# Altium schematic sheet EPS_Battery_Controller_Voltage-Meas.SchDoc: Battery / Voltage Measurement
size A4
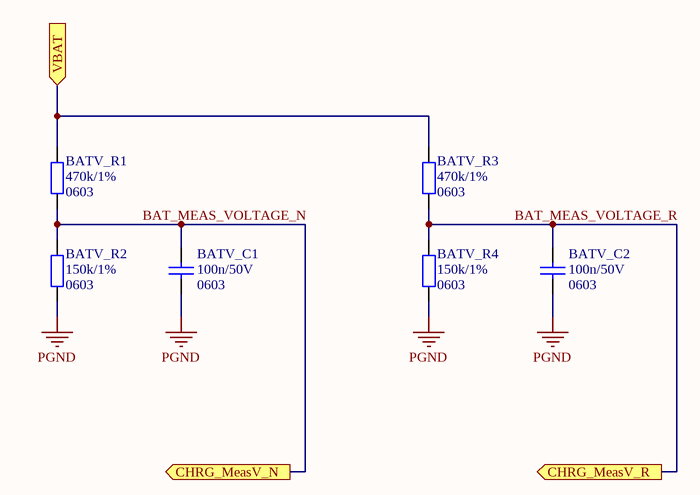
[diagram p0: EPS_Battery_Controller_Voltage-Meas.SchDoc]

## Parts
BATV_C1  Package: 0603  [SMD_Capacitor_0603]  (hidden comment: 100n/50V)
BATV_C2  Package: 0603  [SMD_Capacitor_0603]  (hidden comment: 100n/50V)
BATV_R1  Package: 0603  [SMD_Resistor_0603]  (hidden comment: 470k/1%)
BATV_R2  Package: 0603  [SMD_Resistor_0603]  (hidden comment: 150k/1%)
BATV_R3  Package: 0603  [SMD_Resistor_0603]  (hidden comment: 470k/1%)
BATV_R4  Package: 0603  [SMD_Resistor_0603]  (hidden comment: 150k/1%)

## Ports
CHRG_MeasV_N (out), CHRG_MeasV_R (out), VBAT (in)

## Nets
PGND: BATV_C1.2 BATV_C2.2 BATV_R2.2 BATV_R4.2
BAT_MEAS_VOLTAGE_N: BATV_C1.1 BATV_R1.2 BATV_R2.1 ; port CHRG_MeasV_N
BAT_MEAS_VOLTAGE_R: BATV_C2.1 BATV_R3.2 BATV_R4.1 ; port CHRG_MeasV_R
VBAT: BATV_R1.1 BATV_R3.1 ; port VBAT

## Notes on the sheet
- Title:
- Project:
- Author:
- Model:
- Document Number:
- Checked by:
- Rev:
- Date:
- Approved by:
- Sheet:
- of
- File name:

## Library data of the parts
BATV_C1 BATV_C2 = Cer_C0603T104K5RALTU: Ceramic Cap Kemet COTS 100n/50V X7R 0603; Manufacturer: Kemet; ManufacturerPartNumber: C0603T104K5RALTU; Value: 100n/50V
BATV_R1-BATV_R4 = Res
  BATV_R1 BATV_R3: Value: 470k/1%
  BATV_R2 BATV_R4: Value: 150k/1%